# Altium schematic sheet IRPKrancowki.SchDoc
size A4
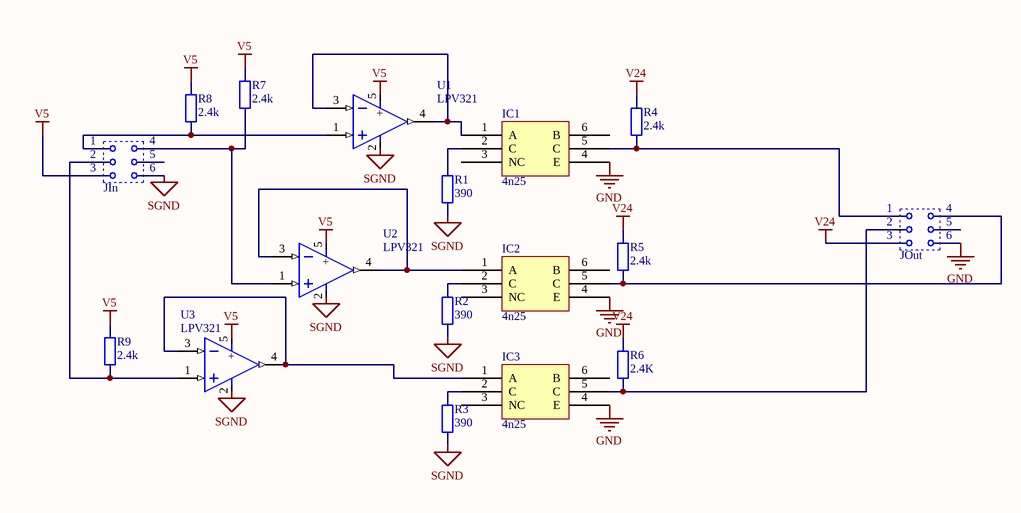
[diagram p0: IRPKrancowki.SchDoc]

## Parts
IC1  4n25  [DIP6]
IC2  4n25  [DIP6]
IC3  4n25  [DIP6]
JIn  Molex Microfit  [MICROFIT 3x2 Right Angle]  (value not drawn)
JOut  Molex Microfit  [MICROFIT 3x2 Right Angle]  (value not drawn)
R1  390  [1206_R]
R2  390  [1206_R]
R3  390  [1206_R]
R4  2.4k  [1206_R]
R5  2.4k  [1206_R]
R6  2.4K  [1206_R]
R7  2.4k  [1206_R]
R8  2.4k  [1206_R]
R9  2.4k  [1206_R]
U1  LPV321  [5SOT-23]
U2  LPV321  [5SOT-23]
U3  LPV321  [5SOT-23]

## Nets
GND: IC1.4(E) IC2.4(E) IC3.4(E) JOut.6
SGND: JIn.6 R1.1 R2.1 R3.1 U1.2(-) U2.2(-) U3.2(-)
V5: JIn.3 R7.2 R8.2 R9.2 U1.5(+) U2.5(+) U3.5(+)
V24: JOut.3 R4.2 R5.2 R6.2
NetIC1_1: IC1.1(A) U1.3(IN-) U1.4(OUT)
NetIC1_2: IC1.2(C) R1.2
NetIC1_5: IC1.5(C) JOut.1 R4.1
NetIC2_1: IC2.1(A) U2.3(IN-) U2.4(OUT)
NetIC2_2: IC2.2(C) R2.2
NetIC2_5: IC2.5(C) JOut.4 R5.1
NetIC3_1: IC3.1(A) U3.3(IN-) U3.4(OUT)
NetIC3_2: IC3.2(C) R3.2
NetIC3_5: IC3.5(C) JOut.2 R6.1
NetJIn_1: JIn.1 R8.1 U1.1(IN+)
NetJIn_2: JIn.2 R9.1 U3.1(IN+)
NetJIn_4: JIn.4 R7.1 U2.1(IN+)

Not connected (* = marked no-connect by the designer): IC1 3(NC) 6(B); IC2 3(NC) 6(B); IC3 3(NC) 6(B); JIn 5; JOut 5

## Library data of the parts
JIn JOut = Microfit 3x2
R1-R9 = R: Resistor